# Altium schematic sheet P25_DI_DO.SchDoc
size 420 x 297 mm
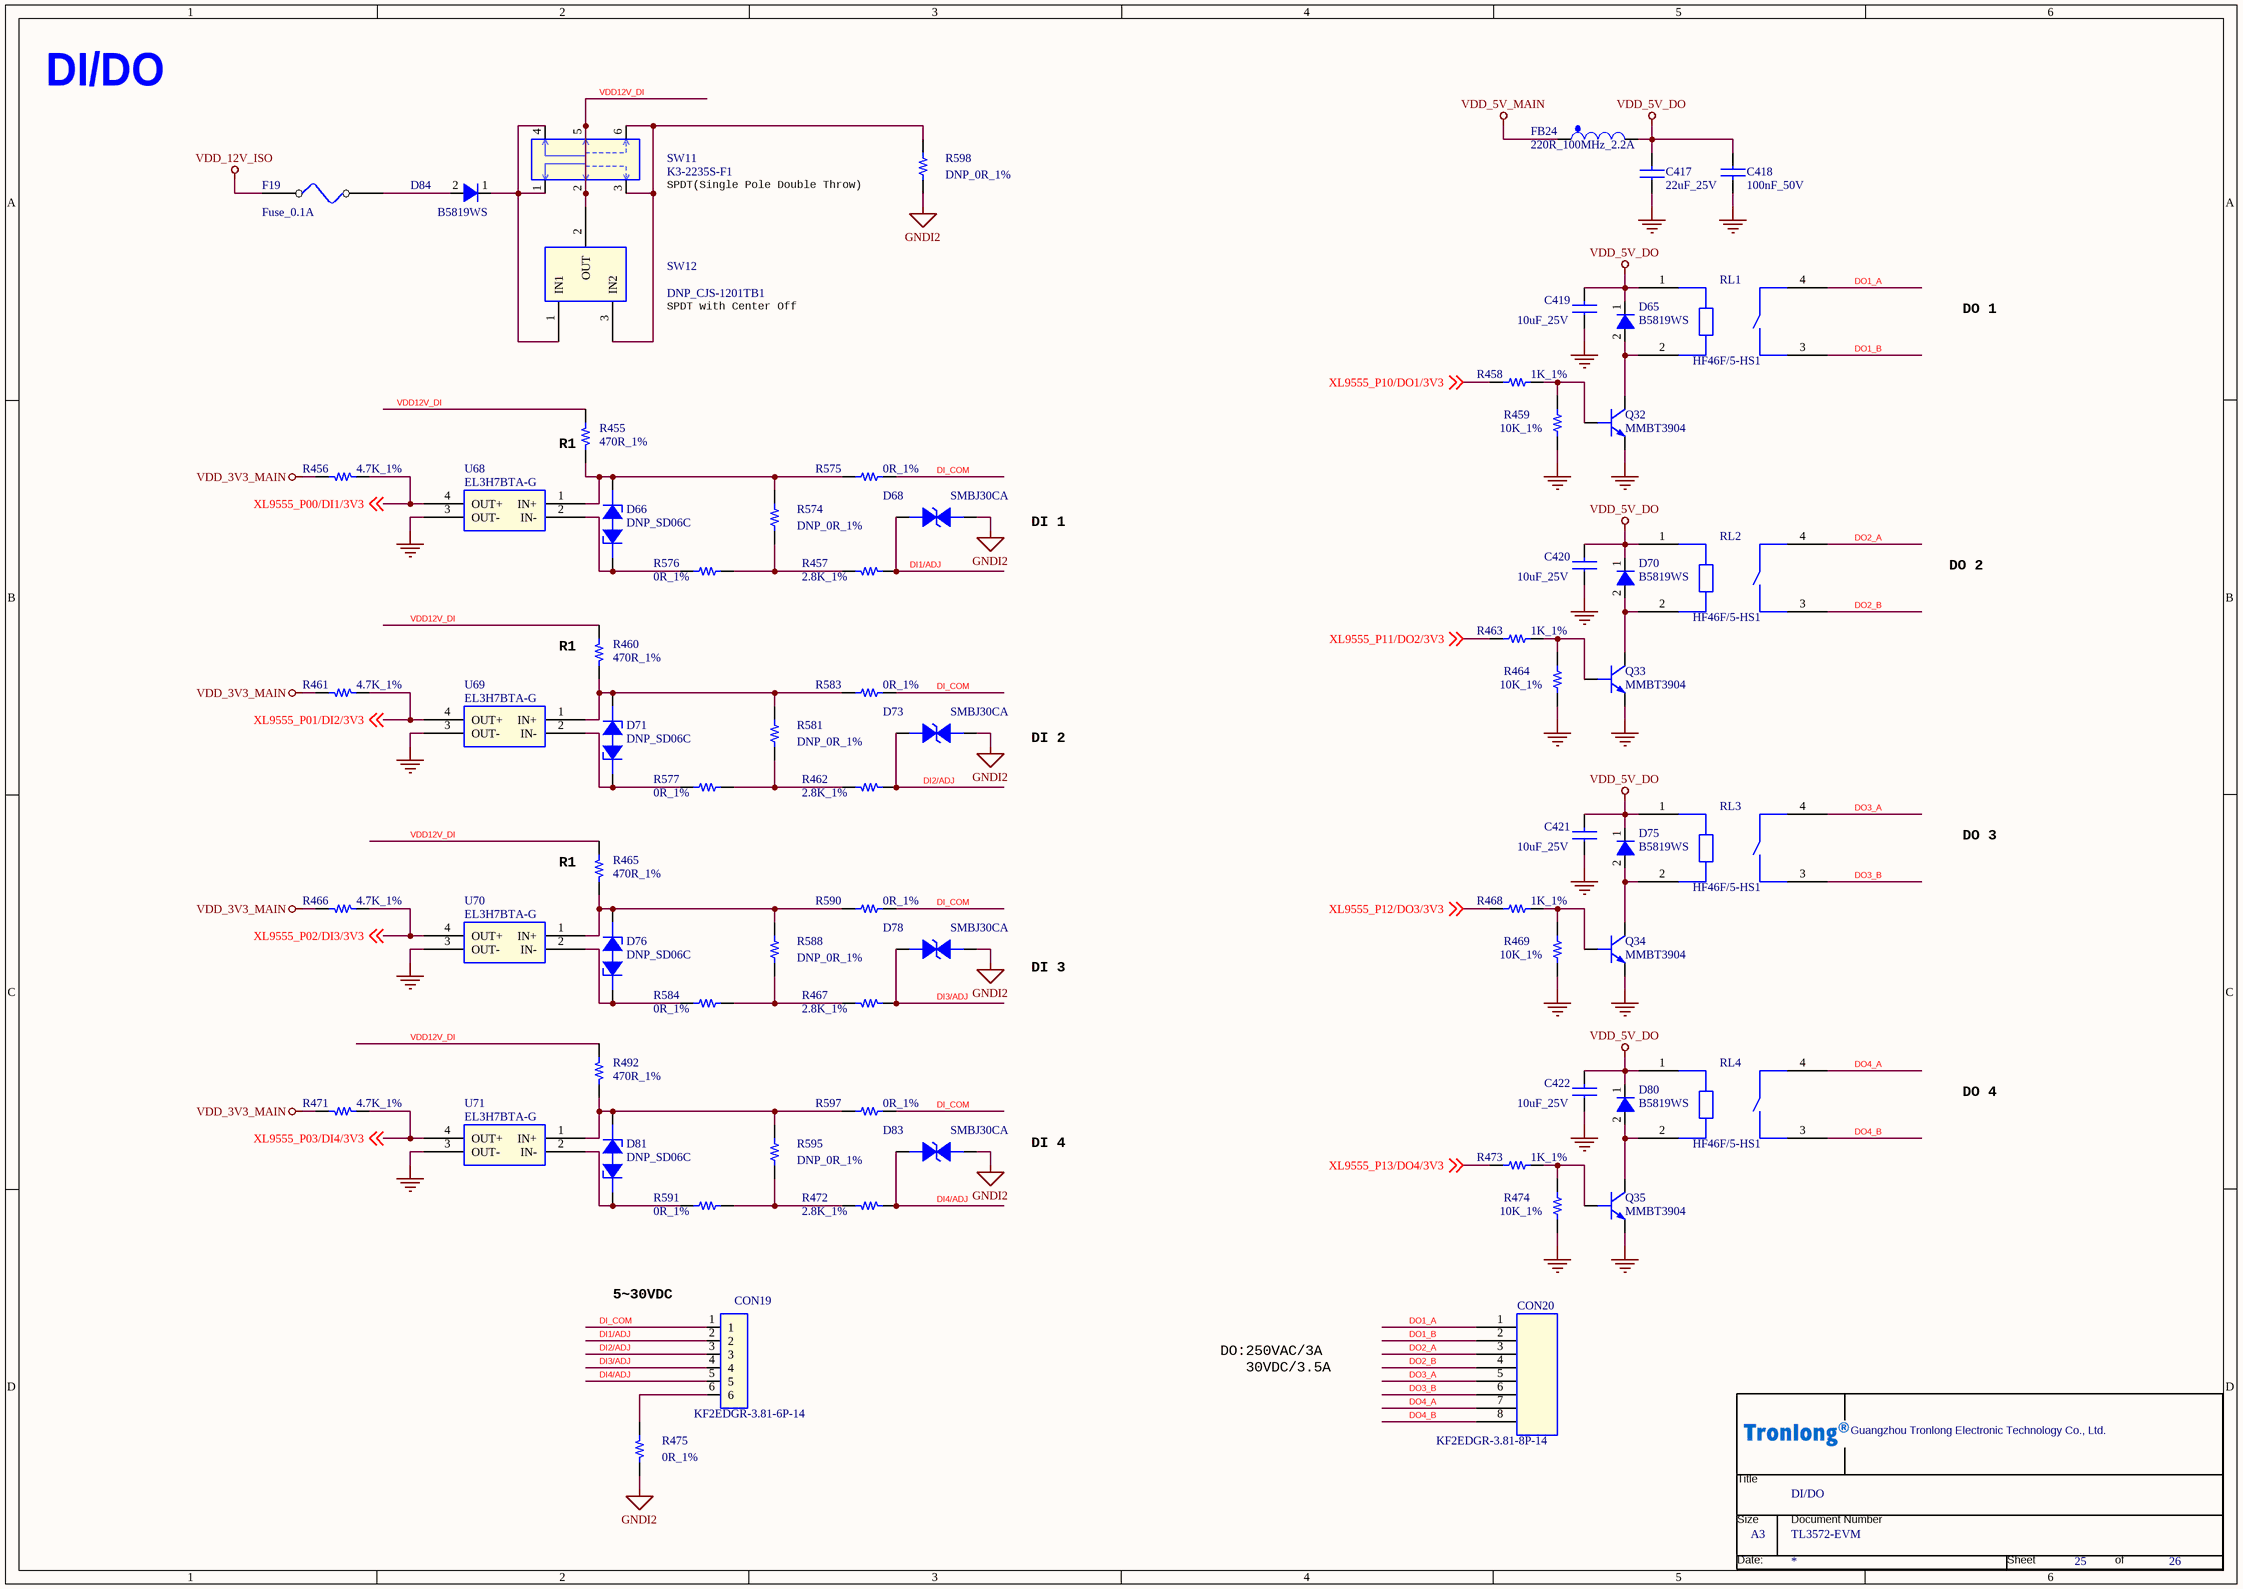
[diagram p0: P25_DI_DO.SchDoc]

## Parts
*  Page Count: 26  Page Number: 25  Page Size: A3  OrgName: Guangzhou Tronlong Electronic Technology Co., Ltd.  Title: DI/DO  Doc: TL3572-EVM  (hidden comment: TL_NEW)  (graphical)
C417  22uF_25V  [C0805]
C418  100nF_50V  [C0402]
C419  10uF_25V  [C0603]
C420  10uF_25V  [C0603]
C421  10uF_25V  [C0603]
C422  10uF_25V  [C0603]
CON19  KF2EDGR-3.81-6P-14  [kf2eg_3_81-6p]
CON20  KF2EDGR-3.81-8P-14  [CON_KF2EDGR-3R81-8P-14_90_DIP]
D65  B5819WS  [SOD-323]
D66  DNP_SD06C  [SOD323]
D68  SMBJ30CA  [SMB]
D70  B5819WS  [SOD-323]
D71  DNP_SD06C  [SOD323]
D73  SMBJ30CA  [SMB]
D75  B5819WS  [SOD-323]
D76  DNP_SD06C  [SOD323]
D78  SMBJ30CA  [SMB]
D80  B5819WS  [SOD-323]
D81  DNP_SD06C  [SOD323]
D83  SMBJ30CA  [SMB]
D84  B5819WS  [SOD-323]
F19  Fuse_0.1A  [F0805]
FB24  220R_100MHz_2.2A  [L0603]
Q32  MMBT3904  [SOT23-3_DBZ3]
Q33  MMBT3904  [SOT23-3_DBZ3]
Q34  MMBT3904  [SOT23-3_DBZ3]
Q35  MMBT3904  [SOT23-3_DBZ3]
R455  470R_1%  [R0603]
R456  4.7K_1%  [R0402]
R457  2.8K_1%  [R0603]
R458  1K_1%  [R0402]
R459  10K_1%  [R0402]
R460  470R_1%  [R0603]
R461  4.7K_1%  [R0402]
R462  2.8K_1%  [R0603]
R463  1K_1%  [R0402]
R464  10K_1%  [R0402]
R465  470R_1%  [R0603]
R466  4.7K_1%  [R0402]
R467  2.8K_1%  [R0603]
R468  1K_1%  [R0402]
R469  10K_1%  [R0402]
R471  4.7K_1%  [R0402]
R472  2.8K_1%  [R0603]
R473  1K_1%  [R0402]
R474  10K_1%  [R0402]
R475  0R_1%  [R0603]
R492  470R_1%  [R0603]
R574  DNP_0R_1%  [R0402]
R575  0R_1%  [R0402]
R576  0R_1%  [R0402]
R577  0R_1%  [R0402]
R581  DNP_0R_1%  [R0402]
R583  0R_1%  [R0402]
R584  0R_1%  [R0402]
R588  DNP_0R_1%  [R0402]
R590  0R_1%  [R0402]
R591  0R_1%  [R0402]
R595  DNP_0R_1%  [R0402]
R597  0R_1%  [R0402]
R598  DNP_0R_1%  [R1206]
RL1  HF46F/5-HS1  [RTL_HF46F-5-HS1]
RL2  HF46F/5-HS1  [RTL_HF46F-5-HS1]
RL3  HF46F/5-HS1  [RTL_HF46F-5-HS1]
RL4  HF46F/5-HS1  [RTL_HF46F-5-HS1]
SW11  K3-2235S-F1  [SW-6P-L9169P2D5-SMD]
SW12  DNP_CJS-1201TB1  [SW_SMD_3P_L60W25_P350_LS42]
U68  EL3H7BTA-G  [soic127p700x200-4n]
U69  EL3H7BTA-G  [soic127p700x200-4n]
U70  EL3H7BTA-G  [soic127p700x200-4n]
U71  EL3H7BTA-G  [soic127p700x200-4n]

## Nets
GND: C417.1 C418.2 C419.1 C420.1 C421.1 C422.1 Q32.2(E) Q33.2(E) Q34.2(E) Q35.2(E) R459.2 R464.2 R469.2 R474.2 U68.3(OUT-) U69.3(OUT-) U70.3(OUT-) U71.3(OUT-)
GNDI2: D68.1 D73.1 D78.1 D83.1 R475.2 R598.1
VDD_3V3_MAIN: R456.1 R461.1 R466.1 R471.1
VDD_5V_DO: C417.2 C418.1 C419.2 C420.2 C421.2 C422.2 D65.1(Anode) D70.1(Anode) D75.1(Anode) D80.1(Anode) FB24.2 RL1.1 RL2.1 RL3.1 RL4.1
VDD_5V_MAIN: FB24.1
VDD_12V_ISO: F19.1
DI1/ADJ: CON19.2 D68.2 R457.2
DI2/ADJ: CON19.3 D73.2 R462.2
DI3/ADJ: CON19.4 D78.2 R467.2
DI4/ADJ: CON19.5 D83.2 R472.2
DI_COM: CON19.1 R575.2 R583.2 R590.2 R597.2
DO1_A: CON20.1 RL1.4
DO1_B: CON20.2 RL1.3
DO2_A: CON20.3 RL2.4
DO2_B: CON20.4 RL2.3
DO3_A: CON20.5 RL3.4
DO3_B: CON20.6 RL3.3
DO4_A: CON20.7 RL4.4
DO4_B: CON20.8 RL4.3
VDD12V_DI: R455.1 R460.1 R465.1 R492.1 SW11.2 SW11.5 SW12.2(OUT)
XL9555_P00/DI1/3V3: R456.2 U68.4(OUT+) ; off-sheet XL9555_P00/DI1/3V3
XL9555_P01/DI2/3V3: R461.2 U69.4(OUT+) ; off-sheet XL9555_P01/DI2/3V3
XL9555_P02/DI3/3V3: R466.2 U70.4(OUT+) ; off-sheet XL9555_P02/DI3/3V3
XL9555_P03/DI4/3V3: R471.2 U71.4(OUT+) ; off-sheet XL9555_P03/DI4/3V3
XL9555_P10/DO1/3V3: R458.2 ; off-sheet XL9555_P10/DO1/3V3
XL9555_P11/DO2/3V3: R463.2 ; off-sheet XL9555_P11/DO2/3V3
XL9555_P12/DO3/3V3: R468.2 ; off-sheet XL9555_P12/DO3/3V3
XL9555_P13/DO4/3V3: R473.2 ; off-sheet XL9555_P13/DO4/3V3
NetCON19_6: CON19.6 R475.1
NetD65_2: D65.2(Cathode) Q32.3(C) RL1.2
NetD66_1: D66.1(ANODE1) R455.2 R574.1 R575.1 U68.1(IN+)
NetD66_2: D66.2(CATHODE2) R576.1 U68.2(IN-)
NetD70_2: D70.2(Cathode) Q33.3(C) RL2.2
NetD71_1: D71.1(ANODE1) R460.2 R581.1 R583.1 U69.1(IN+)
NetD71_2: D71.2(CATHODE2) R577.1 U69.2(IN-)
NetD75_2: D75.2(Cathode) Q34.3(C) RL3.2
NetD76_1: D76.1(ANODE1) R465.2 R588.1 R590.1 U70.1(IN+)
NetD76_2: D76.2(CATHODE2) R584.1 U70.2(IN-)
NetD80_2: D80.2(Cathode) Q35.3(C) RL4.2
NetD81_1: D81.1(ANODE1) R492.2 R595.1 R597.1 U71.1(IN+)
NetD81_2: D81.2(CATHODE2) R591.1 U71.2(IN-)
NetD84_1: D84.1(Cathode) SW11.1 SW11.4 SW12.1(IN1)
NetD84_2: D84.2(Anode) F19.2
NetQ32_1: Q32.1(B) R458.1 R459.1
NetQ33_1: Q33.1(B) R463.1 R464.1
NetQ34_1: Q34.1(B) R468.1 R469.1
NetQ35_1: Q35.1(B) R473.1 R474.1
NetR457_1: R457.1 R574.2 R576.2
NetR462_1: R462.1 R577.2 R581.2
NetR467_1: R467.1 R584.2 R588.2
NetR472_1: R472.1 R591.2 R595.2
NetR598_2: R598.2 SW11.3 SW11.6 SW12.3(IN2)

## Notes on the sheet
- DI/DO
- (near SW11) SPDT(Single Pole Double Throw)
- SPDT with Center Off
- DO 1
- (near R455) R1
- DI 1
- DO 2
- (near R460) R1
- DI 2
- (near R465) R1
- DO 3
- DI 3
- DO 4
- DI 4
- 5~30VDC
- DO:250VAC/3A
  30VDC/3.5A
- (in symbol TL_NEW) Title; Size; Document Number; Date:; Sheet; of

## Library data of the parts
* = TL_NEW: RevCode: A?; Page Create Date: March  8, 1995; Page Modify Date: *; Document: TL3572-EVM
C417 = CAP NP_Dup1: 贴片陶瓷电容,22uF,20%,25V,X5R; Manufacturer PN: C2012X5R1A226K125AB; Manufacturer: 广东风华高新科技股份有限公司（FH）; Manufacturer Character: 中国大陆; Manufacturer PartNumber: 0805X226M250NT; Eco-Label: ROHS; Operation Temperature（℃）: -55~+85(Ta); As-Welded: /; Priority: A; ERP Number: 005.0001.0001.00524; Dielectric: X5R; Part Type: C0805; RK PN: C2012X5R1A226K125AB; Part Status: 优选; PCB Footprint: C0805
C418 = CAP NP_Dup1: 贴片陶瓷电容,100nF,10%,50V,X7R; Manufacturer Character: 中国大陆; Manufacturer PN: C1005X5R1A104K050BA; Manufacturer: 广东风华高新科技股份有限公司（FH）; Manufacturer PartNumber: 0402B104K500NT; Eco-Label: ROHS; Operation Temperature（℃）: -55~+125(Ta); As-Welded: /; Dielectric: X5R; Priority: A; ERP Number: 005.0001.0001.00681; Part Type: C0402; RK PN: C1005X5R1A104K050BA; Part Status: 试用; PCB Footprint: C0402
C419 C420 = CAP NP_Dup2: 贴片陶瓷电容10uF,20%,25V,X5R; Manufacturer PartNumber: 0603X106M250NT; Manufacturer: 广东风华高新科技股份有限公司（FH）; Manufacturer Character: 中国大陆; Eco-Label: ROHS; Operation Temperature（℃）: -55~+85(Ta); room: RS232; As-Welded: /; ERP Number: 005.0001.0001.00527; Temperature: -55~125℃; Part Status: 优选; PCB Footprint: C0603
C421 C422 = CAP NP_Dup2: 贴片陶瓷电容10uF,20%,25V,X5R; Manufacturer Character: 中国大陆; Manufacturer: 广东风华高新科技股份有限公司（FH）; Manufacturer PartNumber: 0603X106M250NT; Eco-Label: ROHS; As-Welded: /; room: RS232; Operation Temperature（℃）: -55~+85(Ta); ERP Number: 005.0001.0001.00527; Temperature: -55~125℃; Part Status: 优选; PCB Footprint: C0603
CON19 = CON6: 插拔式端子座,1x6P,3.81mm,90度; Manufacturer Character: 中国大陆; Manufacturer: 慈溪市科发电子有限公司（KEFA）; Operation Temperature（℃）: -40~+105(Ta); As-Welded: /; ERP Number: 005.0001.0003.00419; Eco-Label: ROHS; Manufacturer PartNumber: KF2EDGR-3.81-6P-14; Part Status: 优选; PCB Footprint: kf2eg_3_81-6p
CON20 = CON8_1: 插拔式端子座,1x8P,3.81mm,90度; Manufacturer Character: 中国大陆; Manufacturer: 慈溪市科发电子有限公司（KEFA）; Eco-Label: ROHS; Operation Temperature（℃）: -40~+105(Ta); As-Welded: /; PCB Footprint: CON_KF2EDGR-3R81-8P-14_90_DIP; Manufacturer PartNumber: KF2EDGR-3.81-8P-14
D65 D75 D80 = Diode200mA250V_2: 肖特基二极管,VR=40V,IF=1A,VF=0.6V@1A; Mfr: On Semiconductor; MfrNum: MMSD103T1G; TIIntPartnumber: 1E0013; Manufacturer Character: 中国大陆; Manufacturer: 江苏长晶科技股份有限公司（JSCJ）; Descriptive_Text: Diode 200mA 250V 1.25V Forward Drop; Vendor: Digikey; Cost100: 0.23; Cost10K: 0.07; PCB Footprint: smd123; Eco-Label: ROHS; As-Welded: /; Operation Temperature（℃）: -55~+125(Tj); ERP Number: 005.0001.0010.00093; PartName: Diode200mA250V; DescriptiveText: Diode 200mA 250V 1.25V Forward Drop; Part Status: 优选; Temperature: -40~125℃; Manufacturer PartNumber: B5819WS
D66 D71 D76 D81 = DIODE BREAKDOWN_2: TVS二极管,VRWM=6V,VBR=6.5V,一组,双向,30KV,30KV; Manufacturer Character: 中国大陆; Manufacturer: 上海雷卯电子科技有限公司（Leiditech）; Manufacturer PartNumber: SD06C; Manufacturer Part Number: PESD3V3L1BA; ERP Number: 005.0001.0017.00096; room: KEY; Operation Temperature（℃）: -55~+150(Tj); As-Welded: DNP; Eco-Label: ROHS; Temperature: -55~155℃; Part Status: 试用; PCB Footprint: SOD323
D68 = DIODE-TRIG: TVS二极管,VRWM=30V,VBR=33.3V,一组,双向; Manufacturer: 江苏长晶科技有限公司（JSCJ）; Manufacturer Character: 中国大陆; Eco-Label: ROHS; ERP Number: 005.0001.0017.00058; room: DCIN; Operation Temperature（℃）: -55~+150(Tj); As-Welded: /; PCB Footprint: SMB; Part Status: 优选; Manufacturer PartNumber: SMBJ30CA; Temperature: -55~150℃
D70 = Diode200mA250V_2: 肖特基二极管,VR=40V,IF=1A,VF=0.6V@1A; Mfr: On Semiconductor; MfrNum: MMSD103T1G; TIIntPartnumber: 1E0013; Manufacturer: 江苏长晶科技股份有限公司（JSCJ）; Manufacturer Character: 中国大陆; Descriptive_Text: Diode 200mA 250V 1.25V Forward Drop; Vendor: Digikey; Cost100: 0.23; Cost10K: 0.07; PCB Footprint: smd123; Eco-Label: ROHS; Operation Temperature（℃）: -55~+125(Tj); As-Welded: /; ERP Number: 005.0001.0010.00093; PartName: Diode200mA250V; DescriptiveText: Diode 200mA 250V 1.25V Forward Drop; Part Status: 优选; Manufacturer PartNumber: B5819WS; Temperature: -40~125℃
D73 D78 D83 = DIODE-TRIG: TVS二极管,VRWM=30V,VBR=33.3V,一组,双向; Manufacturer Character: 中国大陆; Manufacturer: 江苏长晶科技有限公司（JSCJ）; As-Welded: /; Operation Temperature（℃）: -55~+150(Tj); room: DCIN; ERP Number: 005.0001.0017.00058; Eco-Label: ROHS; PCB Footprint: SMB; Temperature: -55~150℃; Manufacturer PartNumber: SMBJ30CA; Part Status: 优选
D84 = Diode200mA250V: 肖特基二极管,VR=40V,IF=1A,VF=0.6V@1A; TIIntPartnumber: 1E0013; MfrNum: MMSD103T1G; Mfr: On Semiconductor; Manufacturer: 江苏长晶科技股份有限公司（JSCJ）; Manufacturer Character: 中国大陆; DescriptiveText: Diode 200mA 250V 1.25V Forward Drop; PCB Footprint: smd123; Cost10K: 0.07; Cost100: 0.23; Vendor: Digikey; Eco-Label: ROHS; Operation Temperature（℃）: -55~+125(Tj); As-Welded: /; ERP Number: 005.0001.0010.00093; PartName: Diode200mA250V; Descriptive_Text: Diode 200mA 250V 1.25V Forward Drop; Part Status: 优选; Manufacturer PartNumber: B5819WS; Temperature: -55~150
F19 = FUSE: 自恢复保险丝,Vmax=24V,Imax=100A,Ihold=0.1A; Manufacturer Character: 中国大陆; Manufacturer: 东莞市竞沃电子科技有限公司（TLC）; Manufacturer PartNumber: TLC-PSMD010/24; ERP Number: 005.0001.0011.00038; As-Welded: /; Operation Temperature（℃）: -40~+85(Ta); Eco-Label: ROHS; PCB Footprint: F0805; Part Status: 测评; Temperature: -55~125℃
FB24 = FB_0: 磁珠,50mΩ,2.2A,220R@100MHz; Manufacturer Character: 中国大陆; Manufacturer PartNumber: UPZ1608U221-2R2TF; Manufacturer: 深圳顺络电子股份有限公司（Sunlord）; Operation Temperature（℃）: -55~+125(Ta); Eco-Label: ROHS; ERP Number: 005.0001.0007.00015; As-Welded: /; Temperature: -55~125℃; Part Status: 限选; PCB Footprint: L0603
Q32 Q34 = MMBT3904/SOT: BJT,NPN,Vceo=40V,Ic=200mA,fT=300MHz,PD=200mW; Manufacturer: 江苏长晶科技股份有限公司（JSCJ）; Manufacturer Character: 中国大陆; ERP Number: 005.0001.0008.00002; Eco-Label: ROHS; As-Welded: /; Operation Temperature（℃）: -55~+150(Tj); PCB Footprint: SOT23-3_DBZ3; Manufacturer PartNumber: MMBT3904; Temperature: -55~150℃; Part Status: 优选
Q33 = MMBT3904/SOT: BJT,NPN,Vceo=40V,Ic=200mA,fT=300MHz,PD=200mW; Manufacturer: 江苏长晶科技股份有限公司（JSCJ）; Manufacturer Character: 中国大陆; ERP Number: 005.0001.0008.00002; As-Welded: /; Operation Temperature（℃）: -55~+150(Tj); Eco-Label: ROHS; PCB Footprint: SOT23-3_DBZ3; Manufacturer PartNumber: MMBT3904; Temperature: -55~150℃; Part Status: 优选
Q35 = MMBT3904/SOT: BJT,NPN,Vceo=40V,Ic=200mA,fT=300MHz,PD=200mW; Manufacturer Character: 中国大陆; Manufacturer: 江苏长晶科技股份有限公司（JSCJ）; ERP Number: 005.0001.0008.00002; Eco-Label: ROHS; Operation Temperature（℃）: -55~+150(Tj); As-Welded: /; PCB Footprint: SOT23-3_DBZ3; Temperature: -55~150℃; Manufacturer PartNumber: MMBT3904; Part Status: 优选
R455 = Resistor: 贴片电阻,470R,±1%,1/10W; Manufacturer: 广东风华高新科技股份有限公司（FH）; Manufacturer PartNumber: RS-03K4700FT; Manufacturer Character: 中国大陆; CLASS: DISCRETE; Eco-Label: ROHS; As-Welded: /; Operation Temperature（℃）: -55~+125(Ta); ERP Number: 005.0001.0002.01346; Part Status: 试用; PCB Footprint: R0603
R456 = Resistor: 贴片电阻,4.7K,±1%,1/16W; Manufacturer: 广东风华高新科技股份有限公司（FH）; Manufacturer PartNumber: RC-02K4701FT; Manufacturer Character: 中国大陆; CLASS: DISCRETE; As-Welded: /; Operation Temperature（℃）: -55~+125(Ta); ERP Number: 005.0001.0002.01359; Eco-Label: ROHS; Part Status: 试用; PCB Footprint: R0402
R457 = Resistor: /; Manufacturer PartNumber: 2.8K,±1%,R0603,≥1/10W; Manufacturer: 广州创龙; CLASS: DISCRETE; ERP Number: 005.0001.0023.00354; Operation Temperature（℃）: -40~+85(Ta); Eco-Label: ROHS; Part Status: -; As-Welded: /; Manufacturer Character: -; PCB Footprint: R0603
R458 R463 = Resistor: 贴片电阻,1K,±1%,1/16W; Manufacturer PartNumber: RC-02K1001FT; Manufacturer: 广东风华高新科技股份有限公司（FH）; Manufacturer Character: 中国大陆; CLASS: DISCRETE; Eco-Label: ROHS; Operation Temperature（℃）: -55~+125(Ta); As-Welded: /; ERP Number: 005.0001.0002.01327; Part Status: 优选; PCB Footprint: R0402
R459 R464 = Resistor: 贴片电阻,10K,±1%,1/16W; Manufacturer: 广东风华高新科技股份有限公司（FH）; Manufacturer PartNumber: RC-02K1002FT; Manufacturer Character: 中国大陆; CLASS: DISCRETE; ERP Number: 005.0001.0002.01326; room: DRDUSB; Operation Temperature（℃）: -55~+125(Ta); As-Welded: /; Eco-Label: ROHS; Temperature: -55~125℃; Part Status: 优选; PCB Footprint: R0402
R460 R465 R492 = Resistor: 贴片电阻,470R,±1%,1/10W; Manufacturer Character: 中国大陆; Manufacturer PartNumber: RS-03K4700FT; Manufacturer: 广东风华高新科技股份有限公司（FH）; CLASS: DISCRETE; ERP Number: 005.0001.0002.01346; Operation Temperature（℃）: -55~+125(Ta); As-Welded: /; Eco-Label: ROHS; Part Status: 试用; PCB Footprint: R0603
R461 R466 R471 = Resistor: 贴片电阻,4.7K,±1%,1/16W; Manufacturer Character: 中国大陆; Manufacturer PartNumber: RC-02K4701FT; Manufacturer: 广东风华高新科技股份有限公司（FH）; CLASS: DISCRETE; Eco-Label: ROHS; ERP Number: 005.0001.0002.01359; Operation Temperature（℃）: -55~+125(Ta); As-Welded: /; Part Status: 试用; PCB Footprint: R0402
R462 R467 R472 = Resistor: /; Manufacturer: 广州创龙; Manufacturer PartNumber: 2.8K,±1%,R0603,≥1/10W; CLASS: DISCRETE; Eco-Label: ROHS; Operation Temperature（℃）: -40~+85(Ta); ERP Number: 005.0001.0023.00354; Manufacturer Character: -; As-Welded: /; Part Status: -; PCB Footprint: R0603
R468 = Resistor: 贴片电阻,1K,±1%,1/16W; Manufacturer Character: 中国大陆; Manufacturer: 广东风华高新科技股份有限公司（FH）; Manufacturer PartNumber: RC-02K1001FT; CLASS: DISCRETE; Eco-Label: ROHS; As-Welded: /; Operation Temperature（℃）: -55~+125(Ta); ERP Number: 005.0001.0002.01327; Part Status: 优选; PCB Footprint: R0402
R469 R474 = Resistor: 贴片电阻,10K,±1%,1/16W; Manufacturer Character: 中国大陆; Manufacturer PartNumber: RC-02K1002FT; Manufacturer: 广东风华高新科技股份有限公司（FH）; CLASS: DISCRETE; Eco-Label: ROHS; As-Welded: /; Operation Temperature（℃）: -55~+125(Ta); room: DRDUSB; ERP Number: 005.0001.0002.01326; Temperature: -55~125℃; Part Status: 优选; PCB Footprint: R0402
R473 = Resistor: 贴片电阻,1K,±1%,1/16W; Manufacturer Character: 中国大陆; Manufacturer: 广东风华高新科技股份有限公司（FH）; Manufacturer PartNumber: RC-02K1001FT; CLASS: DISCRETE; ERP Number: 005.0001.0002.01327; As-Welded: /; Operation Temperature（℃）: -55~+125(Ta); Eco-Label: ROHS; Part Status: 优选; PCB Footprint: R0402
R475 = Resistor: 贴片电阻,0R,±1%,1/8W; Manufacturer Character: 中国大陆; Manufacturer PartNumber: RC-03000FT; Manufacturer: 广东风华高新科技股份有限公司（FH）; CLASS: DISCRETE; Eco-Label: ROHS; ERP Number: 005.0001.0002.00956; As-Welded: /; Operation Temperature（℃）: -55~+155(Ta); Part Status: 优选; Temperature: –55~155℃; PCB Footprint: R0603
R574 R581 R588 = Resistor_Dup3: 贴片电阻,0R,±1%,1/16W; Manufacturer Character: 中国大陆; Manufacturer PartNumber: RC-02000FT; Manufacturer: 广东风华高新科技股份有限公司（FH）; CLASS: DISCRETE; ERP Number: 005.0001.0002.00938; Operation Temperature（℃）: -55~+155(Ta); As-Welded: DNP; Eco-Label: ROHS; PCB Footprint: R0402; Part Status: 优选
R575-R577 R583 R584 R590 R591 R597 = Resistor_Dup3: 贴片电阻,0R,±1%,1/16W; Manufacturer Character: 中国大陆; Manufacturer PartNumber: RC-02000FT; Manufacturer: 广东风华高新科技股份有限公司（FH）; CLASS: DISCRETE; ERP Number: 005.0001.0002.00938; Operation Temperature（℃）: -55~+155(Ta); As-Welded: /; Eco-Label: ROHS; Part Status: 优选; PCB Footprint: R0402
R595 = Resistor_Dup3: 贴片电阻,0R,±1%,1/16W; Manufacturer: 广东风华高新科技股份有限公司（FH）; Manufacturer PartNumber: RC-02000FT; Manufacturer Character: 中国大陆; CLASS: DISCRETE; Eco-Label: ROHS; As-Welded: DNP; Operation Temperature（℃）: -55~+155(Ta); ERP Number: 005.0001.0002.00938; Part Status: 优选; PCB Footprint: R0402
R598 = Resistor_Dup3: 贴片电阻,0R,±1%,1/4W; Manufacturer: 广东风华高新科技股份有限公司（FH）; Manufacturer PartNumber: RS-06000FT; Manufacturer Character: 中国大陆; CLASS: DISCRETE; ERP Number: 005.0001.0002.01440; Operation Temperature（℃）: -55~+155(Ta); room: USB HUB; As-Welded: DNP; Eco-Label: ROHS; Part Status: 测评; PCB Footprint: R1206
RL1 RL3 = RTL_HF46F-5-HS1: 继电器,5V,一组转换,单刀单掷,5A; Manufacturer: 厦门宏发电声股份有限公司(HONGFA); Manufacturer Character: 中国大陆; ERP Number: 005.0001.0013.00005; Eco-Label: ROHS; Operation Temperature（℃）: -40~+85(Ta); As-Welded: /; PCB Footprint: RTL_HF46F-5-HS1; Manufacturer PartNumber: HF46F/5-HS1; Part Status: 测评
RL2 RL4 = RTL_HF46F-5-HS1: 继电器,5V,一组转换,单刀单掷,5A; Manufacturer Character: 中国大陆; Manufacturer: 厦门宏发电声股份有限公司(HONGFA); ERP Number: 005.0001.0013.00005; Eco-Label: ROHS; As-Welded: /; Operation Temperature（℃）: -40~+85(Ta); PCB Footprint: RTL_HF46F-5-HS1; Manufacturer PartNumber: HF46F/5-HS1; Part Status: 测评
SW11 = SW_2P2T: 贴片拨动开关,2P2T,180,黑色,无定位柱; Manufacturer Character: 国外; Manufacturer: HRO(韩国韩荣); Eco-Label: ROHS; Operation Temperature（℃）: -40~+85(Ta); As-Welded: /; ERP Number: 005.0001.0016.00086; PCB Footprint: SW-6P-L9169P2D5-SMD; Part Status: 测评; ERP PCB Footprint: SW-6P-L9169P2D5-SMD; Manufacturer PartNumber: K3-2235S-F1
SW12 = CMX309_1: LPD_Part_Number: 1012777; Mfr_Part_Number: S3M24.576B20F30TNN; Mfr_Name: Citizen; room: 14; As-Welded: DNP; Part Status: 试用; ROHS: Yes; DATASHEET_PATH: M:\OrCad\CIS_database\Logic_Data_Sheets\Crystals_Oscillators\Citizen\CSX_750F.pdf; WEB_LINK: http://LPDSRV18.logicpd.com:8010/Everest_LOGIC/HcmServlet?action=OpenEmailObject&classid=21&objid=6273689; Temperature: -40~85℃; PCB Footprint: SW_SMD_3P_L60W25_P350_LS42
U68 = PC817: 光耦,VF=1.2V,IF=50mA,IO=50mA,VCEO=80V,1通道; Manufacturer Character: 中国台湾; Manufacturer: EVERLIGHT(台湾亿光电子工业股份有限公司); ERP Number: 005.0001.0018.00013; Operation Temperature（℃）: -55~+110(Ta); As-Welded: /; Eco-Label: ROHS; PCB Footprint: soic127p700x200-4n; Manufacturer PartNumber: EL3H7BTA-G; Part Status: 试用
U69-U71 = PC817: 光耦,VF=1.2V,IF=50mA,IO=50mA,VCEO=80V,1通道; Manufacturer: EVERLIGHT(台湾亿光电子工业股份有限公司); Manufacturer Character: 中国台湾; Eco-Label: ROHS; As-Welded: /; Operation Temperature（℃）: -55~+110(Ta); ERP Number: 005.0001.0018.00013; PCB Footprint: soic127p700x200-4n; Part Status: 试用; Manufacturer PartNumber: EL3H7BTA-G